# Altium project CPCIS_PWR_MOD_AC.PrjPCB (part 2 of 2)

## Sheet PWR_stage_AC.SchDoc
size 420 x 297 mm; SPICEModelCacheMYOJSQKR: <root> / <DocumentId>MYOJSQKR</DocumentId> / <CacheFrame Number="0"> / <Model Name="890283326009cs_1uf" Kind="CKT"> / <Text>******* / .subckt 890283326009CS_1uF 1 2 / Rser 1 3 0.0252581351943 / Lser 2 4 1.0459517867E-08 / C1 3 4 0.000001 / Rpar 3 4 10000000000 / .ends 890283326009CS_1uF</Text> / </Model> / <Model Name="1210_885342209009_1nf" Kind="CKT"> / <Text>******* / .subckt 1210_885342209009_1nF 1 2 / Rser 1 3 0.343504568556 / Lser 2 4 3.91503622E-10 / C1 3 4 0.000000001 / Rpar 3 4 10000000000 / .ends 1210_885342209009_1nF</Text> / </Model> / <Model Name="1812_885342211008_4.7nf" Kind="CKT"> / <Text>******* / .subckt 1812_885342211008_4.7nF 1 2 / Rser 1 3 0.157731534341 / Lser 2 4 5.5102414E-10 / C1 3 4 0.0000000047 / Rpar 3 4 10000000000 / .ends 1812_885342211008_4.7nF</Text> / </Model> / <Model Name="1210_885342209004_33nf" Kind="CKT"> / <Text>******* / .subckt 1210_885342209004_33nF 1 2 / Rser 1 3 0.0267458879248 / Lser 2 4 3.56097176E-10 / C1 3 4 0.000000033 / Rpar 3 4 3030000000 / .ends 1210_885342209004_33nF</Text> / </Model> / <Model Name="890334026027cs_1uf" Kind="CKT"> / <Text>******* / .subckt 890334026027CS_1uF 1 2 / Rser 1 3 0.033 / Lser 2 4 0.0000000137 / C1 3 4 0.000001 / Rpar 3 4 10000000000 / .ends 890334026027CS_1uF</Text> / </Model> / <Model Name="861011385023_0.33mf" Kind="CKT"> / <Text>***** / .subckt 861011385023_0.33mF 1 2 / Rser 1 3 0.22242 / Lser 2 4 1.2037845668E-08 / C1 3 4 0.00033 / Rpar 3 4 151515.151515152 / .ends 861011385023_0.33mF</Text> / </Model> / <Model Name="860080474012_330uf" Kind="CKT"> / <Text>******* / .subckt 860080474012_330uF 1 2 / Rser 1 3 0.047373566599 / Lser 2 4 6.401102138E-09 / C1 3 4 0.00033 / Rpar 3 4 303030.303030303 / .ends 860080474012_330uF</Text> / </Model> / </CacheFrame> / </root>
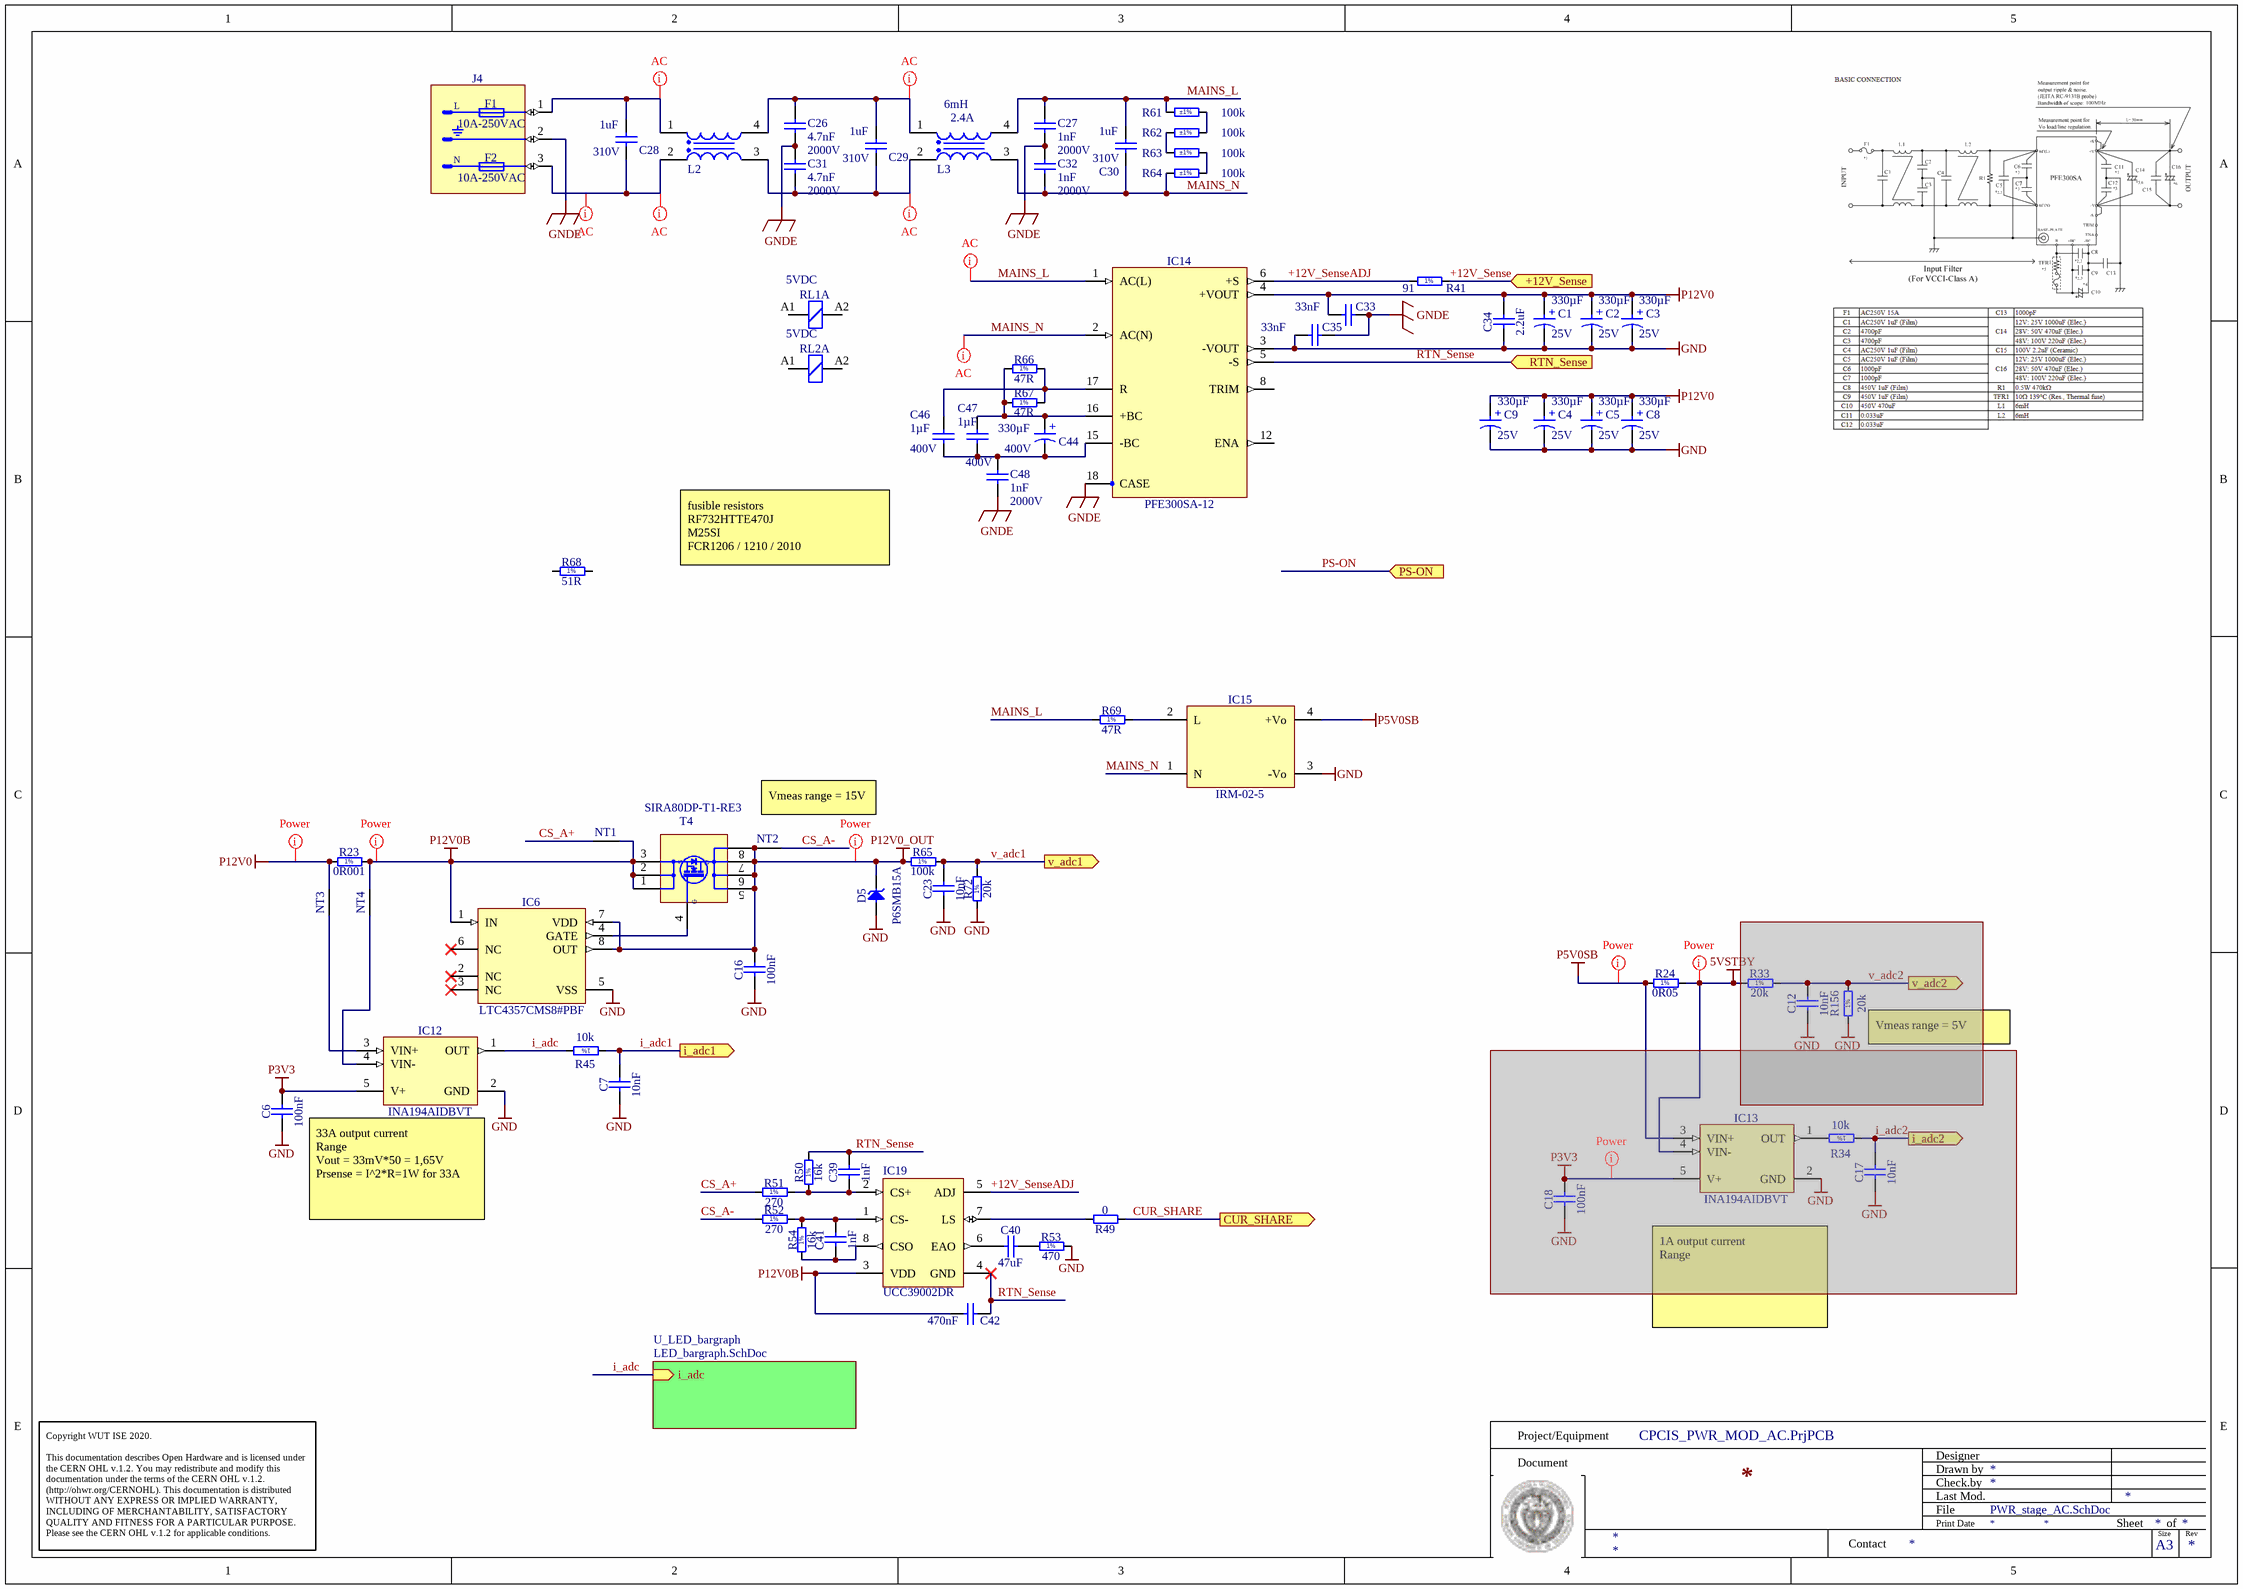
[diagram p1: PWR_stage_AC.SchDoc]

### Parts
(Parts that share a designator on the sheet are numbered #1, #2 ... from top to bottom, then left to right.)
C1#2  Rated Voltage (DC): 25V  [WCAP-ATLI_D8H16]  (hidden comment: 330µF)
C2#2  Rated Voltage (DC): 25V  [WCAP-ATLI_D8H16]  (hidden comment: 330µF)
C3#2  Rated Voltage (DC): 25V  [WCAP-ATLI_D8H16]  (hidden comment: 330µF)
C4#2  Rated Voltage (DC): 25V  [WCAP-ATLI_D8H16]  (hidden comment: 330µF)
C5#2  Rated Voltage (DC): 25V  [WCAP-ATLI_D8H16]  (hidden comment: 330µF)
C6  100nF  [CAPC1005X55N]
C7  10nF  [CAPC1005X55N]
C8#2  Rated Voltage (DC): 25V  [WCAP-ATLI_D8H16]  (hidden comment: 330µF)
C9#2  Rated Voltage (DC): 25V  [WCAP-ATLI_D8H16]  (hidden comment: 330µF)
C12  10nF  [CAPC1005X55N]  (masked out: inside a compile mask, not in the netlist)
C16  100nF  [CAPC1005X55N]
C17  10nF  [CAPC1005X55N]  (masked out: inside a compile mask, not in the netlist)
C18  100nF  [CAPC1005X55N]  (masked out: inside a compile mask, not in the netlist)
C23  10nF  [CAPC1005X55N]
C26  Rated Voltage (DC): 2000V  [WCAP-CSMH_1812_L4.5W3.2H2]  (hidden comment: 4.7nF)
C27  Rated Voltage (DC): 2000V  [WCAP-CSMH_1210_L3.2W2.5H1.25]  (hidden comment: 1nF)
C28  Rated Voltage (AC): 310V  [WCAP-FTXX_L26W11H20_CS]  (hidden comment: 1uF)
C29  Rated Voltage (AC): 310V  [WCAP-FTXX_L26W11H20_CS]  (hidden comment: 1uF)
C30  Rated Voltage (AC): 310V  [WCAP-FTXX_L26W11H20_CS]  (hidden comment: 1uF)
C31  Rated Voltage (DC): 2000V  [WCAP-CSMH_1812_L4.5W3.2H2]  (hidden comment: 4.7nF)
C32  Rated Voltage (DC): 2000V  [WCAP-CSMH_1210_L3.2W2.5H1.25]  (hidden comment: 1nF)
C33  33nF  [WCAP-CSMH_1210_L3.2W2.5H1.6]
C34  2.2uF  [CAPC2013X145N]
C35  33nF  [WCAP-CSMH_1210_L3.2W2.5H1.6]
C39  1nF  [CAPC1005X55N]
C40  47uF  [CAPC1608X100N]
C41  1nF  [CAPC1005X55N]
C42  470nF  [CAPC1608X87N]
C44  Rated Voltage (DC): 400V  [WCAP-AIG8_D30H30]  (hidden comment: 330µF)
C46  Rated Voltage (DC): 400V  [WCAP-FTBP_L26W8.5H17]  (hidden comment: 1µF)
C47  Rated Voltage (DC): 400V  [WCAP-FTBP_L26W8.5H17]  (hidden comment: 1µF)
C48  Rated Voltage (DC): 2000V  [WCAP-CSMH_1210_L3.2W2.5H1.25]  (hidden comment: 1nF)
D5  P6SMB15A  [DIOM5436X261N]
F1  10A-250VAC  [FUSE_5X20_GLASS_v]
F2  10A-250VAC  [FUSE_5X20_GLASS_v]
IC6  LTC4357CMS8#PBF  [SOP65P490X110-8N]
IC12  INA194AIDBVT  [SOT95P280X145-5N]
IC13  INA194AIDBVT  [SOT95P280X145-5N]  (masked out: inside a compile mask, not in the netlist)
IC14  PFE300SA-12  [PWS_TDK-LAMBDA_PFE300/500SA]
IC15  IRM-02-5  [PWS_MEANWELL_IRM-02]
IC19  UCC39002DR  [D0008A_N]
J4  IEC  [SCHURTER_GSF1.2202.31]  (value not drawn)
L2  6mH  [WE-FCLP_FT16H]  (value not drawn)
L3  Rated Current: 2.4A  [WE-FCLP_FT16H]  (hidden comment: 6mH)
NT1  Net Tie  [Net Tie]  (value not drawn)  (net tie, no BOM)
NT2  Net Tie  [Net Tie]  (value not drawn)  (net tie, no BOM)
NT3  Net Tie  [Net Tie]  (value not drawn)  (net tie, no BOM)
NT4  Net Tie  [Net Tie]  (value not drawn)  (net tie, no BOM)
R23  0R001  [RESM11670X254N]
R24  0R05  [RESC2012X60N]
R33  20k  [RESC1005X40N]  (masked out: inside a compile mask, not in the netlist)
R34  10k  [RESC1005X40N]  (masked out: inside a compile mask, not in the netlist)
R41  91  [RESC1608X55N]
R45  10k  [RESC1005X40N]
R49  0  [RESC1608X55N]
R50  16k  [RESC1608X55N]
R51  270  [RESC1608X55N]
R52  270  [RESC1608X55N]
R53  470  [RESC1005X40N]
R54  16k  [RESC1608X55N]
R61  100k  Tolerance: ±1%  [RESC3216X65N]
R62  100k  Tolerance: ±1%  [RESC3216X65N]
R63  100k  Tolerance: ±1%  [RESC3216X65N]
R64  100k  Tolerance: ±1%  [RESC3216X65N]
R65  100k  [RESC1005X40N]
R66  47R  [RESC5025X65N]
R67  47R  [RESC5025X65N]
R68  51R  [RESC5025X65N]
R69  47R  [RESC5025X65N]
R72  20k  [RESC1005X40N]
R156  20k  [RESC1005X40N]  (masked out: inside a compile mask, not in the netlist)
RL1  value 5VDC  [REL_TYCO-SCHRACK_SNR]  (hidden comment: REL_TYCO-SCHRACK_SNR Form A)  (part A of 2)
RL2  value 5VDC  [REL_TYCO-SCHRACK_SNR]  (hidden comment: REL_TYCO-SCHRACK_SNR Form C)  (part A of 2)
T4  SIRA80DP-T1-RE3  [VISHAY_POWERPAK-SO-8-SINGLE]

### Sub-sheets
U_LED_bargraph = LED_bargraph.SchDoc: i_adc (in)

### Ports
+12V_Sense (in), CUR_SHARE (out), i_adc1 (out), i_adc2 (out), PS-ON (in), RTN_Sense (in), v_adc1 (out), v_adc2 (out)

### Nets
5VSTBY: R24.2
GND: C1#2.2(N) C2#2.2(N) C3#2.2(N) C4#2.2(N) C5#2.2(N) C6.1 C7.1 C8#2.2(N) C9#2.2(N) C16.1 C23.1 C34.1 C35.2 D5.2(A) IC6.5(VSS) IC12.2(GND) IC14.3(-VOUT) IC15.3(-Vo) R53.2 R72.1
GNDE: C26.1 C27.1 C31.2 C32.2 C33.1 C35.1 C48.1 IC14.18(CASE) J4.2
P3V3: C6.2 IC12.5(V+)
P5V0SB: IC15.4(+Vo) R24.1
P12V0: C1#2.1(P) C2#2.1(P) C3#2.1(P) C4#2.1(P) C5#2.1(P) C8#2.1(P) C9#2.1(P) C33.2 C34.2 IC14.4(+VOUT) NT3.2 R23.1
P12V0_OUT: C16.2 D5.1(C) IC6.7(VDD) IC6.8(OUT) NT2.1 R65.1 T4.D
P12V0B: C42.2 IC6.1(IN) IC19.3(VDD) NT1.2 NT4.2 R23.2 T4.1(S) T4.2(S) T4.3(S)
+12V_Sense: R41.1 ; port +12V_Sense
+12V_SenseADJ: IC14.6(+S) IC19.5(ADJ) R41.2
CS_A+: NT1.1 R51.1
CS_A-: NT2.2 R52.1
CUR_SHARE: R49.1 ; port CUR_SHARE
i_adc: IC12.1(OUT) R45.2 ; sheet U_LED_bargraph/i_adc
i_adc1: C7.2 R45.1 ; port i_adc1
MAINS_L: C27.2 C30.2 IC14.1(AC(L)) L3.4 R61.1 R69.1
MAINS_N: C30.1 C32.1 IC14.2(AC(N)) IC15.1(N) L3.3 R64.1
RTN_Sense: C39.2 C42.1 IC14.5(-S) IC19.4(GND) R50.2 ; port RTN_Sense
v_adc1: C23.2 R65.2 R72.2 ; port v_adc1
NetC26_2: C26.2 C29.2 L2.4 L3.1
NetC28_1: C28.1 J4.3 L2.2
NetC28_2: C28.2 J4.1 L2.1
NetC29_1: C29.1 C31.1 L2.3 L3.2
NetC39_1: C39.1 IC19.2(CS+) R50.1 R51.2
NetC40_1: C40.1 IC19.6(EAO)
NetC40_2: C40.2 R53.1
NetC41_1: C41.1 IC19.8(CSO) R54.1
NetC41_2: C41.2 IC19.1(CS-) R52.2 R54.2
NetC44_1: C44.1(P) C47.2 IC14.16(+BC) R66.1 R67.1
NetC44_2: C44.2(N) C46.1 C47.1 C48.2 IC14.15(-BC)
NetC46_2: C46.2 IC14.17(R) R66.2 R67.2
NetIC6_4: IC6.4(GATE) T4.4(S)
NetIC12_3: IC12.3(VIN+) NT3.1
NetIC12_4: IC12.4(VIN-) NT4.1
NetIC15_2: IC15.2(L) R69.2
NetIC19_7: IC19.7(LS) R49.2
NetR61_2: R61.2 R62.2
NetR62_1: R62.1 R63.1
NetR63_2: R63.2 R64.2

Not connected (* = marked no-connect by the designer): IC6 2(NC)* 3(NC)* 6(NC)*; IC14 8(TRIM) 12(ENA); R68 1 2; RL1 A1 A2; RL2 A1 A2

### Layout directives
net class Power: 5VSTBY, (no net found under the mark), P5V0SB, P12V0, P12V0_OUT, P12V0B
net class AC: MAINS_L, MAINS_N, NetC26_2, NetC28_1, NetC28_2, NetC29_1

### Notes on the sheet
- fusible resistors
  RF732HTTE470J
  M25SI
  FCR1206 / 1210 / 2010
  tht FKN100JR-73-10R
- Vmeas range = 15V
- (near R156) Vmeas range = 5V
- 33A output current
  Range
  Vout = 33mV*50 = 1,65V
  Prsense = I^2*R=1W for 33A
- 1A output current
  Range
- Project/Equipment
- Document
- Designer
- Drawn by
- Check.by
- Copyright WUT ISE 2020.
  This documentation describes Open Hardware and is licensed under the CERN OHL v.1.2. You may redistribute and modify this documentation under the terms of the CERN OHL v.1.2. (http://ohwr.org/CERNOHL). This documentation is distributed WITHOUT ANY EXPRESS OR IMPLIED WARRANTY, INCLUDING OF MERCHANTABILITY, SATISFACTORY QUALITY AND FITNESS FOR A PARTICULAR PURPOSE. Please see the CERN OHL v.1.2 for applicable conditions.
- Contact
- File
- Last Mod.
- Print Date
- Sheet
- Size
- A3
- of
- Rev
- (in symbol 860080474012) +
- (in symbol 861011385023) +
- (in symbol Q_SIRA80DP-T1-RE3) 7; 6; G; 5
- (in symbol R0402_10K_1%_0.0625W_100PPM) 1%
- (in symbol R0402_20K_1%_0.0625W_100PPM) 1%
- (in symbol R0402_100K_1%_0.0625W_100PPM) 1%
- (in symbol R0402_470R_1%_0.0625W_100PPM) 1%
- (in symbol R0603_16K_1%_0.1W_100PPM) 1%
- (in symbol R0603_91R_1%_0.1W_100PPM) 1%
- (in symbol R0603_270R_1%_0.1W_100PPM) 1%
- (in symbol R0805_0R05_1%_0.25W_300PPM) 1%
- (in symbol R4527_0R001_1%_2W_75PPM) 1%
- (in symbol RES_2010_51R) 1%
- (in symbol SCHURTER_GSF1.2202.31) L; N

### Library data of the parts
C1#2 C2#2 C3#2 C4#2 C5#2 C8#2 C9#2 = 860080474012: WCAP-ATLI Aluminum Electrolytic Capacitor, Radial, THT, D8 x H16mm, 330µF, 25V; Manufacturer: Wurth Elektronik; Capacitance Tolerance: +/-20%; Dissipation Factor: 10%; Endurance: 3000h; Leakage Current: 82.5µA; Ripple Current: 990mA; Technical Reference: ATEE160331M025DSPA7C000; Manufacturer Part Number: 860080474012; Category: Aluminum Electrolytic Capacitors; Match Code: WCAP-ATLI; ComponentLink1Description: Website Link; ComponentLink1URL: https://www.we-online.com/redexpert/article/860080474012?ad; ComponentLink2Description: Datasheet Link; ComponentLink2URL: https://www.we-online.com/redexpert/spec/860080474012?ad; Mount: Through Hole; Operating Temperature Max: 105°C; Operating Temperature Min: -55°C; Packaging: Ammo Pack; Height: 16mm; Diameter: 8mm; Capacitance: 330µF
C6 C16 C18 = CC0402_100NF_25V_10%_X7R_YUDEN_TMK105B7104KVHF: Non-polarised capacitor; Part Description: SMD Multilayer Chip Ceramic Capacitor (High Dielectric Type) for Automotive / Industrial Applications; Manufacturer: TAIYO YUDEN; Voltage: 25V; TC: X7R; Tolerance: ±10%; Part Number: CC0402_100NF_25V_10%_X7R_YUDEN_TMK105B7104KVHF; Component Kind: Standard; Component Type: Standard; Pin Count: 2; Value: 100nF; Status: Not Recommended; Manufacturer Part Number: TMK105B7104KVHF; Case: 0402; Mounted: Yes; Socket: No; SMD: Yes; Sense: No; HelpURL: \\cern.ch\dfs\Applications\Altium\Datasheets\CC0402_TAIYO-YUDEN_TMK105B7104KVHF.pdf; Author: CERN DEM JLC; CreateDate: 10/05/2017; LatestRevisionDate: 10/05/2017; ComponentHeight: 0.55mm
C7 C12 C17 C23 = CC0402_10NF_50V_10%_X7R: Non-polarised capacitor; Part Description: SMD Multilayer Chip Ceramic Capacitor; Manufacturer: GENERIC; Manufacturer1 Part Number: GRM155R71H103KA88D; Voltage: 50V; TC: X7R; Tolerance: ±10%; Part Number: CC0402_10NF_50V_10%_X7R; Component Kind: Standard; Component Type: Standard; Pin Count: 2; Value: 10nF; Status: None; Manufacturer Part Number: CC0402_10NF_50V_10%_X7R; Case: 0402; Mounted: Yes; Socket: No; SMD: Yes; Sense: No; Manufacturer1 Example: MURATA; Manufacturer1 ComponentHeight: 0.55mm; HelpURL: \\cern.ch\dfs\Applications\Altium\Datasheets\CC0402_X7R_MURATA_GRM.pdf; Author: CERN DEM MR; CreateDate: 08/01/2016; LatestRevisionDate: 08/01/2016
C26 C31 = 885342211008: WCAP-CSMH Multilayer Ceramic Chip Capacitor, Mid and High Voltage, size 1812, X7R Class II, 4.7nF, 2000VDC; Manufacturer: Wurth Elektronik; Case/Size Code: 1812; Capacitance Tolerance: 10%; Dissipation Factor: 2.5%; Insulation Resistance: 10GΩ; Technical Reference: X7R1812472KB00DFCT10000; Manufacturer Part Number: 885342211008; Category: Multilayer Ceramic Chip Capacitors; Match Code: WCAP-CSMH; ComponentLink1Description: Website Link; ComponentLink1URL: https://www.we-online.com/redexpert/article/885342211008?ad; ComponentLink2Description: Datasheet Link; ComponentLink2URL: https://www.we-online.com/redexpert/spec/885342211008?ad; Mount: Surface Mount; Operating Temperature Max: 125°C; Operating Temperature Min: -55°C; Packaging: Tape and Reel; Length: 4.5mm; Width: 3.2mm; Height: 2mm; Capacitance: 4.7nF; Ceramic Type: X7R Class II
C27 C32 C48 = 885342209009: WCAP-CSMH Multilayer Ceramic Chip Capacitor, Mid and High Voltage, size 1210, X7R Class II, 1nF, 2000VDC; Manufacturer: Wurth Elektronik; Case/Size Code: 1210; Capacitance Tolerance: 10%; Dissipation Factor: 2.5%; Insulation Resistance: 10GΩ; Technical Reference: X7R1210102KB00DFCT10000; Manufacturer Part Number: 885342209009; Category: Multilayer Ceramic Chip Capacitors; Match Code: WCAP-CSMH; ComponentLink1Description: Website Link; ComponentLink1URL: https://www.we-online.com/redexpert/article/885342209009?ad; ComponentLink2Description: Datasheet Link; ComponentLink2URL: https://www.we-online.com/redexpert/spec/885342209009?ad; Mount: Surface Mount; Operating Temperature Max: 125°C; Operating Temperature Min: -55°C; Packaging: Tape and Reel; Length: 3.2mm; Width: 2.5mm; Height: 1.25mm; Capacitance: 1nF; Ceramic Type: X7R Class II
C28-C30 = 890334026027CS: WCAP-FTXX Film Capacitor, THT, L26 x W11 x H20mm, 1uF, 310V; Manufacturer: Wurth Elektronik; Capacitance Tolerance: +/-10%; Dissipation Factor @1kHz: 0.1%; Dissipation Factor @10kHz: 0.7%; Insulation Resistance: 10.00GOhm; Pitch: 22.5mm; Rate of Voltage Rise: 170V/us; Technical Reference: MXXP225105K310ACPP36004; Manufacturer Part Number: 890334026027CS; Category: Film Capacitors; Match Code: WCAP-FTXX; ComponentLink1Description: Website Link; ComponentLink1URL: https://www.we-online.com/redexpert/article/890334026027CS?ad; ComponentLink2Description: Datasheet Link; ComponentLink2URL: https://www.we-online.com/redexpert/spec/890334026027CS?ad; Mount: Through Hole; Operating Temperature Max: 105°C; Operating Temperature Min: -40°C; Packaging: Bulk; Length: 26mm; Width: 11mm; Height: 20mm; Capacitance: 1uF
C33 C35 = 885342209004: WCAP-CSMH Multilayer Ceramic Chip Capacitor, Mid and High Voltage, size 1210, X7R Class II, 33nF, 630VDC; Manufacturer: Wurth Elektronik; Case/Size Code: 1210; Capacitance Tolerance: 10%; Dissipation Factor: 2.5%; Insulation Resistance: 3.03GΩ; Rated Voltage (DC): 630V; Technical Reference: X7R1210333K630DFCT10000; Manufacturer Part Number: 885342209004; Category: Multilayer Ceramic Chip Capacitors; Match Code: WCAP-CSMH; ComponentLink1Description: Website Link; ComponentLink1URL: https://www.we-online.com/redexpert/article/885342209004?ad; ComponentLink2Description: Datasheet Link; ComponentLink2URL: https://www.we-online.com/redexpert/spec/885342209004?ad; Mount: Surface Mount; Operating Temperature Max: 125°C; Operating Temperature Min: -55°C; Packaging: Tape and Reel; Length: 3.2mm; Width: 2.5mm; Height: 1.6mm; Capacitance: 33nF; Ceramic Type: X7R Class II
C34 = CC0805_2.2UF_35V_10%_X7R_TDK_CGA4J1X7R1V225K125AC: Non-polarised capacitor; Part Description: SMD Multilayer Chip Ceramic Capacitor (Automotive Grade); Manufacturer: TDK; Voltage: 35V; TC: X7R; Tolerance: ±10%; Part Number: CC0805_2.2UF_35V_10%_X7R_TDK_CGA4J1X7R1V225K125AC; Component Kind: Standard; Component Type: Standard; Pin Count: 2; Value: 2.2uF; Status: Not Recommended; Manufacturer Part Number: CGA4J1X7R1V225K125; Case: 0805; Mounted: Yes; Socket: No; SMD: Yes; Sense: No; ComponentHeight: 1.45mm; HelpURL: \\cern.ch\dfs\Applications\Altium\Datasheets\CC0805_X7R_TDK_CGA.pdf; Author: CERN DEM BC; CreateDate: 26.02.2016; LatestRevisionDate: 13.09.2016
C39 C41 = CC0402_1NF_50V_10%_X7R: Non-polarised capacitor; Part Description: SMD Multilayer Chip Ceramic Capacitor; Manufacturer: GENERIC; Manufacturer1 Part Number: 223858715623; Voltage: 50V; TC: X7R; Tolerance: ±10%; Part Number: CC0402_1NF_50V_10%_X7R; Component Kind: Standard; Component Type: Standard; Pin Count: 2; Value: 1nF; Status: Not Recommended; Manufacturer Part Number: CC0402_1NF_50V_10%_X7R; Case: 0402; Mounted: Yes; Socket: No; SMD: Yes; Sense: No; Manufacturer1 Example: PHYCOMP; Manufacturer1 ComponentHeight: 0.55mm; HelpURL: \\cern.ch\dfs\Applications\Altium\Datasheets\CC0402_X7R_PHYCOMP.pdf; Author: CERN DEM JLC; CreateDate: 03.12.2007; LatestRevisionDate: 03.12.2007
C40 = CC0603_47UF_6.3V_20%_X5R: Non-polarised capacitor; Part Description: SMD Multilayer Chip Ceramic Capacitor; Manufacturer: GENERIC; Manufacturer1 Part Number: GRM188R60J476ME15D; Voltage: 6.3V; TC: X5R; Tolerance: ±20%; Part Number: CC0603_47UF_6.3V_20%_X5R; Component Kind: Standard; Component Type: Standard; Pin Count: 2; Value: 47uF; Status: None; Manufacturer Part Number: CC0603_47UF_6.3V_20%_X5R; Case: 0603; Mounted: Yes; Socket: No; SMD: Yes; Sense: No; Manufacturer1 Example: MURATA; Manufacturer1 ComponentHeight: 1mm; HelpURL: \\cern.ch\dfs\Applications\Altium\Datasheets\CC0603_MURATA_GRM188R60J476ME15D.pdf; Author: CERN DEM JLC; CreateDate: 01.02.2018; LatestRevisionDate: 01.02.2018
C42 = CC0603_470NF_50V_10%_X5R: Non-polarised capacitor; Part Description: SMD Multilayer Chip Ceramic Capacitor; Manufacturer: GENERIC; Manufacturer1 Part Number: C1608X5R1H474K080; Voltage: 50V; TC: X5R; Tolerance: ±10%; Part Number: CC0603_470NF_50V_10%_X5R; Component Kind: Standard; Component Type: Standard; Pin Count: 2; Value: 470nF; Status: None; Manufacturer Part Number: CC0603_470NF_50V_10%_X5R; Case: 0603; Mounted: Yes; Socket: No; SMD: Yes; Sense: No; Manufacturer1 Example: TDK; Manufacturer1 ComponentHeight: 0.9mm; HelpURL: \\cern.ch\dfs\Applications\Altium\Datasheets\CC0603_X5R_TDK_C.pdf; Author: CERN DEM MR; CreateDate: 29.02.2016; LatestRevisionDate: 29.02.2016
C44 = 861011385023: WCAP-AIG8 Aluminum Electrolytic Capacitor, Snap-In, D30 x H30mm, 330µF, 400V; Manufacturer: Wurth Elektronik; Capacitance Tolerance: +/-20%; Dissipation Factor: 20%; Endurance: 2000h; Leakage Current: 2640µA; Ripple Current: 2050mA; Technical Reference: ANAP300331M400DSIC2B000; Manufacturer Part Number: 861011385023; Category: Aluminum Electrolytic Capacitors; Match Code: WCAP-AIG8; ComponentLink1Description: Website Link; ComponentLink1URL: https://www.we-online.com/redexpert/article/861011385023?ad; ComponentLink2Description: Datasheet Link; ComponentLink2URL: https://www.we-online.com/redexpert/spec/861011385023?ad; Mount: Through Hole; Operating Temperature Max: 85°C; Operating Temperature Min: -25°C; Packaging: Tray; Height: 30mm; Diameter: 30mm; Capacitance: 330µF
C46 C47 = 890283326009CS: WCAP-FTBP Film Capacitor, THT, L26 x W8.5 x H17mm, 1µF, 400V; Manufacturer: Wurth Elektronik; Capacitance Tolerance: +/-5%; Dissipation Factor @1kHz: 0.1%; Dissipation Factor @10kHz: 0.32%; Dissipation Factor @100kHz: 2.2%; Insulation Resistance: 10000Ω x F; Pitch: 22.5mm; Rate of Voltage Rise: 95V/µs; Technical Reference: MPPP225105J400DCPP35004; Manufacturer Part Number: 890283326009CS; Category: Film Capacitors; Match Code: WCAP-FTBP; ComponentLink1Description: Website Link; ComponentLink1URL: https://www.we-online.com/redexpert/article/890283326009CS?ad; ComponentLink2Description: Datasheet Link; ComponentLink2URL: https://www.we-online.com/redexpert/spec/890283326009CS?ad; Mount: Through Hole; Operating Temperature Max: 105°C; Operating Temperature Min: -40°C; Packaging: Carton; Length: 26mm; Width: 8.5mm; Height: 17mm; Capacitance: 1µF
D5 = P6SMB15A: Transient Voltage Suppressor Diode (Uni-Directional); Part Description: Uni-directional Transient Voltage Suppressor (TVS) Diode; Manufacturer: LITTELFUSE; Voltage: 15V; Power: 600W; PressFit: No; Bonding: No; Part Number: P6SMB15A; Component Kind: Standard; Component Type: Standard; Device: P6SMB15A; PackageDescription: DO-214-AA/SMB Diode, Molded Body; 5.40mm L X 3.62mm W X 2.61mm H, IPC Medium Density; Manufacturer Part Number: P6SMB15A; Pin Count: 2; Case: SMB; Mounted: Yes; Socket: No; SMD: Yes; Sense: No; ComponentHeight: 2.61mm; HelpURL: \\cern.ch\dfs\Applications\Altium\Datasheets\P6SMB15A.pdf; Author: CERN DEM JLC; CreateDate: 12.07.2017; LatestRevisionDate: 12.07.2017
F1 F2 = FUSE_SCHURTER_0034.3127_v: Fuse; Part Description: Cylindrical 5x20 mm, Time-Lag T Miniature Fuse, FST Series; PressFit: No; Part Number: FUSE_SCHURTER_0034.3127_v; Component Kind: Accessories; Component Type: Standard; Pin Count: 0; PackageDescription: 5x20mm Cylindrical Fuse, SCHURTER FST5X20 Series; Family: Fuse; Mounted: Yes; Socket: Yes; SMD: No; Sense: No; Value: 10A-250VAC; Manufacturer: SCHURTER; Manufacturer Part Number: 0034.3127; ComponentHeight: 20.5mm; HelpURL: \\cern.ch\dfs\Applications\Altium\Datasheets\FUSE_SCHURTER_FST5X20.pdf; Author: CERN DEM JLC; CreateDate: 28.01.2013; LatestRevisionDate: 28.01.2013
IC6 = LTC4357CMS8#PBF: Positive High Voltage Ideal Diode Controller; Manufacturer: LINEAR TECHNOLOGY; PressFit: No; Bonding: No; Part Number: LTC4357CMS8#PBF; Component Kind: Standard; Component Type: Standard; Device: LTC4357CMS8#PBF; PackageDescription: SOP, 0.65mm, Pitch; 8 Pin, 3.0mm W X 3.0mm L X 1.10mm H Body, IPC Medium Density; Part Description: Positive High Voltage Ideal Diode Controller; Manufacturer Part Number: LTC4357CMS8#PBF; Pin Count: 8; Case: MSOP8; Mounted: Yes; Socket: No; SMD: Yes; Sense: No; ComponentHeight: 1.1mm; Author: GK; HelpURL: \\cern.ch\dfs\Applications\Altium\Datasheets\LTC4359CMS8#PBF.pdf; CreateDate: 25.02.2015; LatestRevisionDate: 25.02.2015
IC12 IC13 = INA194AIDBVT: Current Shunt Monitor -16V to +80V Common-Mode Range; Manufacturer: TEXAS INSTRUMENTS; PressFit: No; Bonding: No; Part Number: INA194AIDBVT; Component Kind: Standard; Component Type: Standard; Device: INA194AIDBVT; PackageDescription: SOT, 0.95mm pitch; 5 pin, 1.60mm W X 2.90mm L X 1.45mm H body, IPC Medium Density; Part Description: Current Shunt Monitor -16V to +80V Common-Mode Range; Manufacturer Part Number: INA194AIDBVT; Pin Count: 5; Case: SOT23-5; Mounted: Yes; Socket: No; SMD: Yes; Sense: No; ComponentHeight: 1.45mm; Author: CERN DEM JLC; HelpURL: \\cern.ch\dfs\Applications\Altium\Datasheets\INA194AIDBVT.pdf; CreateDate: 10.05.2010; LatestRevisionDate: 10.05.2010
IC14 = PWS_TDK-LAMBDA_PFE300SA: 85-264VAC To 12VDC 300W Single Output Power Module; Part Description: 85-264VAC to 12VDC 300W AC-DC Power Module; PressFit: No; Sense Comment: Non-washable; Bonding: No; Status Comment: Sensitive (See Sensitive Field); Part Number: PFE300SA-12; Component Kind: Standard; Component Type: Standard; Device: PFE300SA-12; Footprint: PWS_TDK-LAMBDA_PFE500F; PackageDescription: PFE500F Outline, Body 122x70mm, AC-DC Power Module; Status: Not Recommended; Manufacturer: TDK-LAMBDA; Manufacturer Part Number: PFE300SA-12; Pin Count: 17; Mounted: Yes; Socket: No; SMD: No; Sense: Yes; ComponentHeight: 13.4mm; HelpURL: \\cern.ch\dfs\Applications\Altium\Datasheets\PFE500F-12.pdf; Author: GK; CreateDate: 22.02.2018; LatestRevisionDate: 22.02.2018
IC15 = AC_DC_IRM-02-5: Power Supply; Part Description: 85-305VAC to 5VDC (400mA) 2W Power Supply; Manufacturer: MEAN WELL; PressFit: No; Bonding: No; Part Number: IRM-02-5; Component Kind: Standard; Component Type: Standard; Device: IRM-02-5; PackageDescription: IRM-02 Series, Body 33.7x22.2mm, Power Supply; Status: None; Manufacturer Part Number: IRM-02-5; Pin Count: 4; Mounted: Yes; Socket: No; SMD: No; Sense: No; ComponentHeight: 15mm; HelpURL: \\cern.ch\dfs\Applications\Altium\Datasheets\IRM-02-24.pdf; Author: GK; CreateDate: 14.02.2018; LatestRevisionDate: 14.02.2018
IC19 = CMP-0335-00043-2: Advanced Loadshare Controller with UVLO, 4.375 to 14.25 V Supply, 0 to 70 degC, 8-pin SOIC (D), Green (RoHS & no Sb/Br); Manufacturer: Texas Instruments; Share Bus: Single-Ended; Operating Supply Current(mA): 2.5; Rating: Catalog; Operating Supply(Min)(V): 4.375; UVLO: TRUE; Operating Supply(Max)(V): 14.25; Startup Current(uA): 2500; DatasheetVersion: SLUS495H; ComponentLink1URL: http://www.ti.com/general/docs/lit/getliterature.tsp?genericPartNumber=UCC39002&fileType=pdf; PackageReference: D0008A; ComponentLink1Description: Datasheet; Mounting Technology: Surface Mount; PackageVersion: revM, Jun-2011; SubFamily: Load Share; Code_JEDEC: MS-012AA; PartNumber: UCC39002DR; PackageDescription: 8-Pin Plastic Small Outline Integrated Circuit, 4.9 x 3.9 mm, Pitch 1.27 mm Pitch; Eco-Plan: Green (RoHS & no Sb/Br)
J4 = SCHURTER_GSF1.2202.31: Connector 3 Male 2P+ 2 Fuse Holder; Part Number: SCHURTER_GSF1.2201.31; Part Description: 10A 250Vac Sandwich Panel Mount (1.5mm) Inlet IEC Connector With 2 Fuseholder 5x20mm And Snap-in PCB Mount; Manufacturer Part Number: GSF1.2201.31; PressFit: No; Component Kind: Standard; Component Type: Standard; Footprint: SCHURTER_GSF1.2201.31; Pin Count: 3; Family: IEC; Mounted: Yes; Socket: No; SMD: No; Sense: No; Status: None; Manufacturer: SCHURTER; ComponentHeight: 24.45mm; HelpURL: \\cern.ch\dfs\Applications\Altium\Datasheets\SCHURTER_GSF1.2202.31.pdf; Author: CERN DEM JMW; CreateDate: 20.09.2012; LatestRevisionDate: 20.09.2012
L2 L3 = 744869161063: WE-FCLP THT Common Mode Power Line Choke, FT16H, 6mH, 2.4A, 0.22Ω; Manufacturer: Wurth Elektronik; Insulation Test Voltage: 1.5kV; Leakage Inductance: 120µH; Material: MnZn; Rated Voltage (AC): 250V; ComponentLink1Description: Manufacturer Link; ComponentLink1URL: https://www.we-online.com/redexpert/article/744869161063?ad; ComponentLink2Description: Datasheet; ComponentLink2URL: https://www.we-online.com/redexpert/spec/744869161063?ad; Manufacturer Part Number: 744869161063; Category: Common Mode Chokes; Match Code: WE-FCLP; Mount: Through Hole; Operating Temperature Max: 125°C; Operating Temperature Min: -40°C; Packaging: Tray; Case/Size Code: FT16H; Length: 24.5mm; Width: 15.5mm; Height: 14.5mm; DC Resistance Max: 0.22Ω; Inductance: 6mH
  L2: Rated Current: 2.4A
NT1-NT4 = Net Tie: Part Description: Net Tie (2 Nets); Mounted: No; Part Number: Net Tie; Component Type: Net Tie; Pin Count: 2; Family: Net Tie; Socket: No; SMD: No; Sense: No; Status: None; ComponentHeight: 0mm; HelpURL: Undefined; Author: CERN DEM JLC; CreateDate: 22.03.2011; LatestRevisionDate: 22.03.2011; PackageDescription: 2 Plated Through Hole For Coaxial Cable Link: Hole Dia.=1.4mm Pad Dia.=2.5mm
R23 = R4527_0R001_1%_2W_75PPM: Resistor - 1%; Part Description: Surface Mount Power Metal Strip® Resistor; Manufacturer: VISHAY DALE; Manufacturer Part Number: WSR21L000FEA; Power: 2W; TC: ±75ppm/°C; PressFit: No; Part Number: R4527_0R001_1%_2W_75PPM; Component Kind: Standard; Component Type: Standard; Pin Count: 2; Value: 0R001; Status: None; Tolerance: ±1%; Case: 4527; Mounted: Yes; Sense: No; Socket: No; SMD: Yes; ComponentHeight: 2.53mm; HelpURL: \\cern.ch\dfs\Applications\Altium\Datasheets\R4527_VISHAY_WSR2.pdf; Author: CERN DEM JLC; CreateDate: 22/03/2011; LatestRevisionDate: 22/03/2011
R24 = R0805_0R05_1%_0.25W_300PPM: Resistor - 1%; Part Description: Low Resistance Thick Film Chip Resistor; Manufacturer: GENERIC; Manufacturer1 Part Number: 235051117500L or RL0805FR-7W0R05L; Power: 0.25W; TC: ±300ppm/°C; PressFit: No; Part Number: R0805_0R05_1%_0.25W_300PPM; Component Kind: Standard; Component Type: Standard; Pin Count: 2; Value: 0R05; Status: Not Recommended; Tolerance: ±1%; Manufacturer Part Number: R0805_0R05_1%_0.25W_300PPM; Case: 0805; Mounted: Yes; Sense: No; Socket: No; SMD: Yes; Manufacturer1 Example: YAGEO PHYCOMP; Manufacturer1 ComponentHeight: 0.60mm; HelpURL: \\cern.ch\dfs\Applications\Altium\Datasheets\R0805_Phycomp_RL0805.pdf; Author: CERN DEM MR; CreateDate: 31.03.2016; LatestRevisionDate: 31.03.2016
R33 R72 R156 = R0402_20K_1%_0.0625W_100PPM: Resistor - 1%; Part Description: General Purpose Thick Film Chip Resistor; Manufacturer: GENERIC; Manufacturer1 Part Number: 232270672003L; TC: ±100ppm/°C; PressFit: No; Part Number: R0402_20K_1%_0.0625W_100PPM; Component Kind: Standard; Component Type: Standard; Pin Count: 2; Value: 20k; Status: Not Recommended; Power: 0.0625W; Tolerance: ±1%; Manufacturer Part Number: R0402_20K_1%_0.0625W_100PPM; Case: 0402; Mounted: Yes; Sense: No; Socket: No; SMD: Yes; Manufacturer1 Example: YAGEO PHYCOMP; Manufacturer1 ComponentHeight: 0.4mm; HelpURL: \\cern.ch\dfs\Applications\Altium\Datasheets\R0402_Phycomp_RC0402.pdf; Author: CERN DEM JLC; CreateDate: 03.12.2007; LatestRevisionDate: 17.10.2012
R34 R45 = R0402_10K_1%_0.0625W_100PPM: Resistor - 1%; Part Description: General Purpose Thick Film Chip Resistor; Manufacturer: GENERIC; Manufacturer1 Part Number: 232270671003L; TC: ±100ppm/°C; PressFit: No; Part Number: R0402_10K_1%_0.0625W_100PPM; Component Kind: Standard; Component Type: Standard; Pin Count: 2; Value: 10k; Status: Not Recommended; Power: 0.0625W; Tolerance: ±1%; Manufacturer Part Number: R0402_10K_1%_0.0625W_100PPM; Case: 0402; Mounted: Yes; Sense: No; Socket: No; SMD: Yes; Manufacturer1 Example: YAGEO PHYCOMP; Manufacturer1 ComponentHeight: 0.4mm; HelpURL: \\cern.ch\dfs\Applications\Altium\Datasheets\R0402_Phycomp_RC0402.pdf; Author: CERN DEM JLC; CreateDate: 03/12/2007; LatestRevisionDate: 17/10/2012
R41 = R0603_91R_1%_0.1W_100PPM: Resistor - 1%; Part Description: General Purpose Thick Film Chip Resistor; Manufacturer: GENERIC; Manufacturer1 Part Number: NRC06F91R0TRF; Power: 0.1W; TC: ±100ppm/°C; PressFit: No; Part Number: R0603_91R_1%_0.1W_100PPM; Component Kind: Standard; Component Type: Standard; Pin Count: 2; Value: 91; Status: Preferred; Tolerance: ±1%; Manufacturer Part Number: R0603_91R_1%_0.1W_100PPM; Case: 0603; Mounted: Yes; Sense: No; Socket: No; SMD: Yes; Manufacturer1 Example: NIC COMPONENT; Manufacturer1 ComponentHeight: 0.55mm; HelpURL: \\cern.ch\dfs\Applications\Altium\Datasheets\R0603_NIC_NRC.pdf; Author: CERN DEM JLC; CreateDate: 03.12.2007; LatestRevisionDate: 13.03.2008
R49 = R0603_0R_JUMPER: Resistor; Part Description: 1A (0.05R Max DC Resistance) Zero Ohm Jumper; Manufacturer: GENERIC; Manufacturer1 Part Number: NRC06Z0; PressFit: No; Part Number: R0603_0R_JUMPER; Component Kind: Standard; Component Type: Standard; Pin Count: 2; Value: 0; Status: Preferred; Manufacturer Part Number: R0603_0R_JUMPER; Case: 0603; Mounted: Yes; Sense: No; Socket: No; SMD: Yes; Manufacturer1 Example: NIC COMPONENT; Manufacturer1 ComponentHeight: 0.55mm; HelpURL: \\cern.ch\dfs\Applications\Altium\Datasheets\R0603_NIC_NRC.pdf; Author: CERN DEM JLC; CreateDate: 03.12.2007; LatestRevisionDate: 13.03.2008
R50 R54 = R0603_16K_1%_0.1W_100PPM: Resistor - 1%; Part Description: General Purpose Thick Film Chip Resistor; Manufacturer: GENERIC; Manufacturer1 Part Number: NRC06F1602TRF; Power: 0.1W; TC: ±100ppm/°C; PressFit: No; Part Number: R0603_16K_1%_0.1W_100PPM; Component Kind: Standard; Component Type: Standard; Pin Count: 2; Value: 16k; Status: Preferred; Tolerance: ±1%; Manufacturer Part Number: R0603_16K_1%_0.1W_100PPM; Case: 0603; Mounted: Yes; Sense: No; Socket: No; SMD: Yes; Manufacturer1 Example: NIC COMPONENT; Manufacturer1 ComponentHeight: 0.55mm; HelpURL: \\cern.ch\dfs\Applications\Altium\Datasheets\R0603_NIC_NRC.pdf; Author: CERN DEM JLC; CreateDate: 03.12.2007; LatestRevisionDate: 13.03.2008
R51 R52 = R0603_270R_1%_0.1W_100PPM: Resistor - 1%; Part Description: General Purpose Thick Film Chip Resistor; Manufacturer: GENERIC; Manufacturer1 Part Number: NRC06F2700TRF; Power: 0.1W; TC: ±100ppm/°C; PressFit: No; Part Number: R0603_270R_1%_0.1W_100PPM; Component Kind: Standard; Component Type: Standard; Pin Count: 2; Value: 270; Status: Preferred; Tolerance: ±1%; Manufacturer Part Number: R0603_270R_1%_0.1W_100PPM; Case: 0603; Mounted: Yes; Sense: No; Socket: No; SMD: Yes; Manufacturer1 Example: NIC COMPONENT; Manufacturer1 ComponentHeight: 0.55mm; HelpURL: \\cern.ch\dfs\Applications\Altium\Datasheets\R0603_NIC_NRC.pdf; Author: CERN DEM JLC; CreateDate: 03.12.2007; LatestRevisionDate: 13.03.2008
R53 = R0402_470R_1%_0.0625W_100PPM: Resistor - 1%; Part Description: General Purpose Thick Film Chip Resistor; Manufacturer: GENERIC; Manufacturer1 Part Number: 232270674701L; TC: ±100ppm/°C; PressFit: No; Part Number: R0402_470R_1%_0.0625W_100PPM; Component Kind: Standard; Component Type: Standard; Pin Count: 2; Value: 470; Status: Not Recommended; Power: 0.0625W; Tolerance: ±1%; Manufacturer Part Number: R0402_470R_1%_0.0625W_100PPM; Case: 0402; Mounted: Yes; Sense: No; Socket: No; SMD: Yes; Manufacturer1 Example: YAGEO PHYCOMP; Manufacturer1 ComponentHeight: 0.4mm; HelpURL: \\cern.ch\dfs\Applications\Altium\Datasheets\R0402_Phycomp_RC0402.pdf; Author: CERN DEM JLC; CreateDate: 03.12.2007; LatestRevisionDate: 17.10.2012
R61-R64 = R1206_100K_1%_0.25W_100PPM: Resistor - 1%; Part Description: General Purpose Thick Film Chip Resistor; Manufacturer: GENERIC; Manufacturer1 Part Number: NRC12F1003TRF; Power: 0.25W; TC: ±100ppm/°C; PressFit: No; Part Number: R1206_100K_1%_0.25W_100PPM; Component Kind: Standard; Component Type: Standard; Pin Count: 2; Value: 100k; Status: Preferred; Manufacturer Part Number: R1206_100K_1%_0.25W_100PPM; Case: 1206; Mounted: Yes; Sense: No; Socket: No; SMD: Yes; Manufacturer1 Example: NIC COMPONENT; Manufacturer1 ComponentHeight: 0.65mm; HelpURL: \\cern.ch\dfs\Applications\Altium\Datasheets\R1206_NIC_NRC.pdf; Author: CERN DEM JLC; CreateDate: 03.12.2007; LatestRevisionDate: 13.03.2008
R65 = R0402_100K_1%_0.0625W_100PPM: Resistor - 1%; Part Description: General Purpose Thick Film Chip Resistor; Manufacturer: GENERIC; Manufacturer1 Part Number: 232270671004L; TC: ±100ppm/°C; PressFit: No; Part Number: R0402_100K_1%_0.0625W_100PPM; Component Kind: Standard; Component Type: Standard; Pin Count: 2; Value: 100k; Status: Not Recommended; Power: 0.0625W; Tolerance: ±1%; Manufacturer Part Number: R0402_100K_1%_0.0625W_100PPM; Case: 0402; Mounted: Yes; Sense: No; Socket: No; SMD: Yes; Manufacturer1 Example: YAGEO PHYCOMP; Manufacturer1 ComponentHeight: 0.4mm; HelpURL: \\cern.ch\dfs\Applications\Altium\Datasheets\R0402_Phycomp_RC0402.pdf; Author: CERN DEM JLC; CreateDate: 03/12/2007; LatestRevisionDate: 17/10/2012
R66 R67 R69 = RES_2010_51R: Fusible resistor 47R 0.5W; Manufacturer: KOA; Manufacturer Part Number: RF732HTTE470J; Power: 0.75W; TC: ±200ppm/°C; Tolerance: ±5%; Part Number: Fusible resistor 47R 0.5W; Component Kind: Standard; Component Type: Standard; Pin Count: 2; Value: 47R; Status: Not recommended; Part Description: Fusible resistor 47R 0.5W; Case: 2010; Mounted: Yes; Sense: No; Socket: No; SMD: Yes; ComponentHeight: 0.65mm; HelpURL: \\cern.ch\dfs\Applications\Altium\Datasheets\R2010_YAGEO_RC2010.pdf; Author: GK; CreateDate: 2016-03-13; LatestRevisionDate: 2015-12-04
R68 = RES_2010_51R: Resistor 51R, 0.75W 5%; Part Number: R2010_51R_5%_0.75W_200PPM; Part Description: General Purpose Thick Film Chip Resistor; Manufacturer: VISHAY; Manufacturer Part Number: CRCW201051R0JNEF; TC: ±200ppm/°C; Component Kind: Standard; Component Type: Standard; Pin Count: 2; Value: 51R; Status: Not recommended; Power: 0.75W; Tolerance: ±5%; Case: 2010; Mounted: Yes; Sense: No; Socket: No; SMD: Yes; ComponentHeight: 0.65mm; HelpURL: \\cern.ch\dfs\Applications\Altium\Datasheets\R2010_YAGEO_RC2010.pdf; Author: GK; CreateDate: 2016-03-13; LatestRevisionDate: 2015-12-04
RL1 = REL_TYCO-SCHRACK_V23092-A1005-A202: SNR Slim PCB Relay Form A (1 NO Contact); Part Description: SPST General Purpose  Slim PCB Relay, SNR Series; Manufacturer: TYCO SCHRACK; Manufacturer Part Number: V23092-A1005-A202 or 8-1415067-1; PressFit: No; Sense Comment: Cleaning Limitation; Status Comment: Sensitive (See Sensitive Field); Part Number: REL_TYCO-SCHRACK_V23092-A1005-A202; Component Kind: Standard; Component Type: Standard; Pin Count: 4; PackageDescription: 5 Leads, Body 28.0 x 5mm, Slim PCB Relay SNR Series; Mounted: Yes; Socket: No; SMD: No; Sense: Yes; Status: Not Recommended; ComponentHeight: 15mm; HelpURL: \\cern.ch\dfs\Applications\Altium\Datasheets\REL_TYCO-SCHRACK_SNR.pdf; Author: CERN DEM JLC; CreateDate: 28.04.2009; LatestRevisionDate: 04.09.2018
RL2 = REL_TYCO-SCHRACK_V23092-A1005-A301: SNR Slim PCB Relay Form C (1 CO Contact); Part Description: SPDT General Purpose  Slim PCB Relay, SNR Series; Manufacturer: TYCO SCHRACK; Manufacturer Part Number: V23092-A1005-A301 or 1393236-2; PressFit: No; Sense Comment: Cleaning Limitation; Status Comment: Sensitive (See Sensitive Field); Part Number: REL_TYCO-SCHRACK_V23092-A1005-A301; Component Kind: Standard; Component Type: Standard; Pin Count: 5; PackageDescription: 5 Leads, Body 28.0 x 5mm, Slim PCB Relay SNR Series; Mounted: Yes; Socket: No; SMD: No; Sense: Yes; Status: Not Recommended; ComponentHeight: 15mm; HelpURL: \\cern.ch\dfs\Applications\Altium\Datasheets\REL_TYCO-SCHRACK_SNR.pdf; Author: CERN DEM JLC; CreateDate: 28.01.2009; LatestRevisionDate: 04.09.2018
T4 = Q_SIRA80DP-T1-RE3: 100A N-Channel 30-V (D-S) MOSFET; Part Number: SI7898DP-T1-E3; Manufacturer: VISHAY SILICONIX; PressFit: No; Bonding: No; Component Kind: Standard; Component Type: Standard; Device: SIRA80DP-T1-RE3; PackageDescription: SOIC, 1.27mm Pitch, 8 Pin, Body 5.89mm W X 4.9mm L X 1.12mm H, PowerPAK® SO-8, (SINGLE); Part Description: 100A N-Channel 30-V (D-S) MOSFET; Manufacturer Part Number: SIRA80DP-T1-RE3; Pin Count: 8; Case: SOIC8; Mounted: Yes; Socket: No; SMD: Yes; Sense: No; ComponentHeight: 1.12mm; HelpURL: \\cern.ch\dfs\Applications\Altium\Datasheets\SI7898DP-T1-E3.pdf; Author: GK; CreateDate: 01.01.2020; LatestRevisionDate: 01.01.202005.03.2013

## Sheet LED_bargraph.SchDoc
size A3
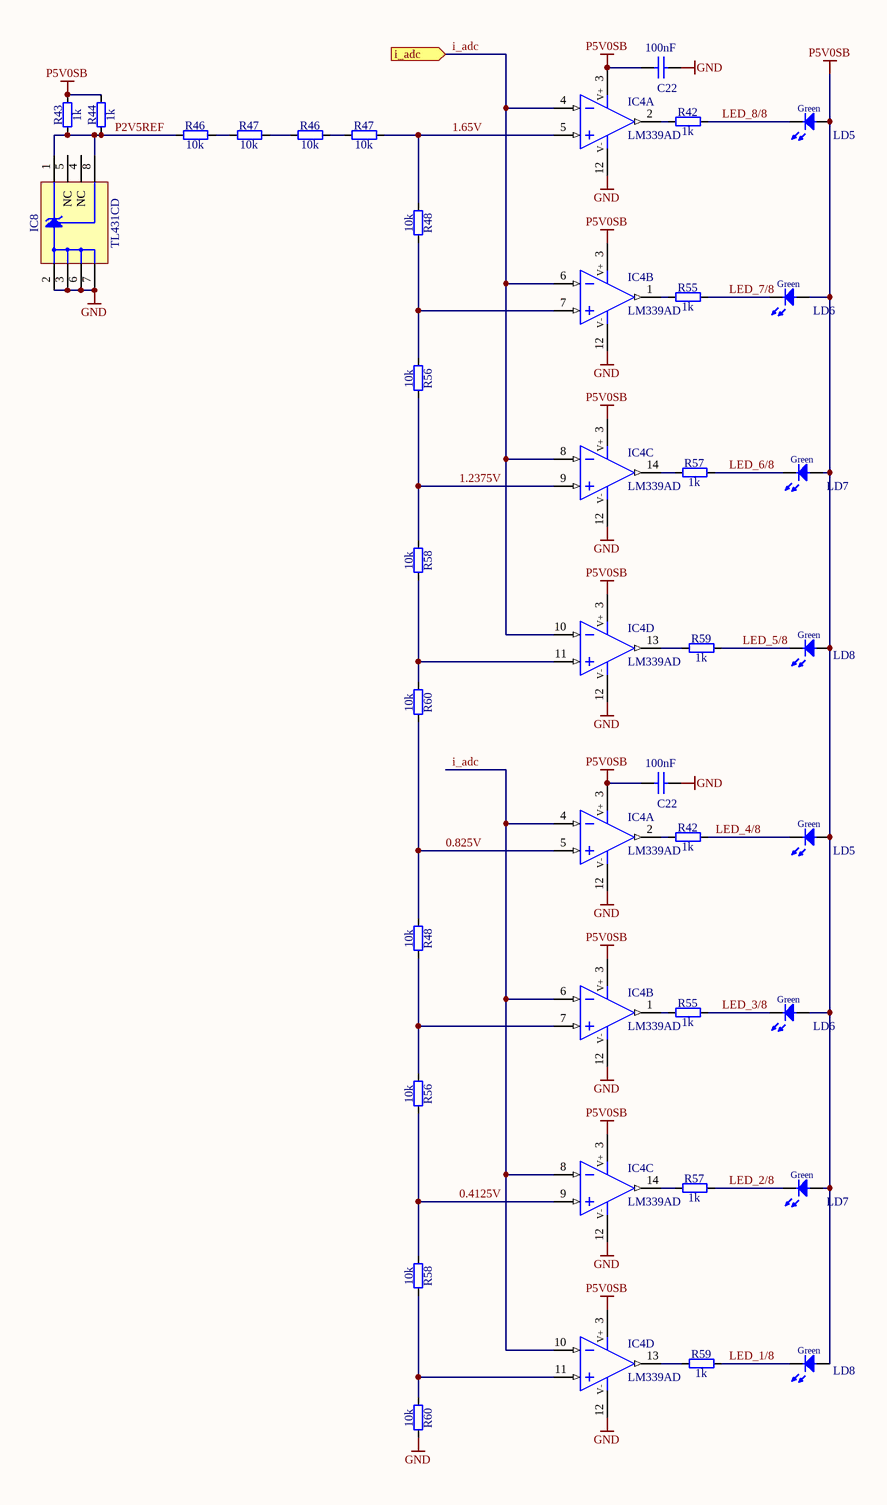
[diagram p2: LED_bargraph.SchDoc]

### Parts
(Parts that share a designator on the sheet are numbered #1, #2 ... from top to bottom, then left to right.)
C22#1  100nF  [CAPC1005X55N]
C22#2  100nF  [CAPC1005X55N]
IC4#1  LM339AD  [SOIC127P600X175-14N]  (parts A,B,C,D of 4)
IC4#2  LM339AD  [SOIC127P600X175-14N]  (parts A,B,C,D of 4)
IC8  TL431CD  [SOIC127P600X175-8N]
LD5#1  Green  [LED_AVAGO_HSME-C120]
LD5#2  Green  [LED_AVAGO_HSME-C120]
LD6#1  Green  [LED_AVAGO_HSME-C120]
LD6#2  Green  [LED_AVAGO_HSME-C120]
LD7#1  Green  [LED_AVAGO_HSME-C120]
LD7#2  Green  [LED_AVAGO_HSME-C120]
LD8#1  Green  [LED_AVAGO_HSME-C120]
LD8#2  Green  [LED_AVAGO_HSME-C120]
R42#1  1k  [RESC1608X55N]
R42#2  1k  [RESC1608X55N]
R43  1k  [RESC1608X55N]
R44  1k  [RESC1608X55N]
R46#1  10k  [RESC1608X55N]
R46#2  10k  [RESC1608X55N]
R47#1  10k  [RESC1608X55N]
R47#2  10k  [RESC1608X55N]
R48#1  10k  [RESC1608X55N]
R48#2  10k  [RESC1608X55N]
R55#1  1k  [RESC1608X55N]
R55#2  1k  [RESC1608X55N]
R56#1  10k  [RESC1608X55N]
R56#2  10k  [RESC1608X55N]
R57#1  1k  [RESC1608X55N]
R57#2  1k  [RESC1608X55N]
R58#1  10k  [RESC1608X55N]
R58#2  10k  [RESC1608X55N]
R59#1  1k  [RESC1608X55N]
R59#2  1k  [RESC1608X55N]
R60#1  10k  [RESC1608X55N]
R60#2  10k  [RESC1608X55N]

### Ports
i_adc (in)

### Nets
GND: C22#1.1 C22#2.1 IC4#1.12(V-) IC4#2.12(V-) IC8.2(A) IC8.3(A) IC8.6(A) IC8.7(A) R60#2.2
P5V0SB: C22#1.2 C22#2.2 IC4#1.3(V+) IC4#2.3(V+) LD5#1.2(A) LD5#2.2(A) LD6#1.2(A) LD6#2.2(A) LD7#1.2(A) LD7#2.2(A) LD8#1.2(A) LD8#2.2(A) R43.2 R44.2
0.825V: IC4#2.5(IN+) R48#2.1 R60#1.2
0.4125V: IC4#2.9(IN+) R56#2.2 R58#2.1
1.65V: IC4#1.5(IN+) R47#2.2 R48#1.1
1.2375V: IC4#1.9(IN+) R56#1.2 R58#1.1
i_adc: IC4#1.4(IN-) IC4#1.6(IN-) IC4#1.8(IN-) IC4#1.10(IN-) IC4#2.4(IN-) IC4#2.6(IN-) IC4#2.8(IN-) IC4#2.10(IN-) ; port i_adc
LED_1/8: LD8#2.1(C) R59#2.2
LED_2/8: LD7#2.1(C) R57#2.2
LED_3/8: LD6#2.1(C) R55#2.2
LED_4/8: LD5#2.1(C) R42#2.2
LED_5/8: LD8#1.1(C) R59#1.2
LED_6/8: LD7#1.1(C) R57#1.2
LED_7/8: LD6#1.1(C) R55#1.2
LED_8/8: LD5#1.1(C) R42#1.2
P2V5REF: IC8.1(C) IC8.8(REF) R43.1 R44.1 R46#1.1
NetIC4#1_1: IC4#1.1(OUT) R55#1.1
NetIC4#1_2: IC4#1.2(OUT) R42#1.1
NetIC4#1_7: IC4#1.7(IN+) R48#1.2 R56#1.1
NetIC4#1_11: IC4#1.11(IN+) R58#1.2 R60#1.1
NetIC4#1_13: IC4#1.13(OUT) R59#1.1
NetIC4#1_14: IC4#1.14(OUT) R57#1.1
NetIC4#2_1: IC4#2.1(OUT) R55#2.1
NetIC4#2_2: IC4#2.2(OUT) R42#2.1
NetIC4#2_7: IC4#2.7(IN+) R48#2.2 R56#2.1
NetIC4#2_11: IC4#2.11(IN+) R58#2.2 R60#2.1
NetIC4#2_13: IC4#2.13(OUT) R59#2.1
NetIC4#2_14: IC4#2.14(OUT) R57#2.1
NetR46#1_2: R46#1.2 R47#1.1
NetR46#2_1: R46#2.1 R47#1.2
NetR46#2_2: R46#2.2 R47#2.1

Not connected (* = marked no-connect by the designer): IC8 4(NC) 5(NC)

### Library data of the parts
C22#1 C22#2 = CC0402_100NF_25V_10%_X7R_YUDEN_TMK105B7104KVHF: as C6 on sheet PWR_stage_AC; Part Number: CC0402_100NF_25V_10%_X7R_YUDEN_TMK105B7104KVHF; Component Kind: Standard; Component Type: Standard; Pin Count: 2; Value: 100nF; Status: Not Recommended; Manufacturer Part Number: TMK105B7104KVHF; Case: 0402; Mounted: Yes; Socket: No; SMD: Yes; Sense: No; HelpURL: \\cern.ch\dfs\Applications\Altium\Datasheets\CC0402_TAIYO-YUDEN_TMK105B7104KVHF.pdf; Author: CERN DEM JLC; CreateDate: 10/05/2017; LatestRevisionDate: 10/05/2017; ComponentHeight: 0.55mm
IC4#1 IC4#2 = LM339AD: Quad Operational Amplifier; Part Description: Quad Differential Comparator; Manufacturer: TEXAS INSTRUMENTS; PressFit: No; Bonding: No; Part Number: LM339AD; Component Kind: Standard; Component Type: Standard; Device: LM339AD; PackageDescription: SOIC 14, Pitch 1.27mm - Body 4x8.75mm, IPC Medium Density; Manufacturer Part Number: LM339AD; Pin Count: 14; Case: SOIC14; Mounted: Yes; Socket: No; SMD: Yes; Sense: No; ComponentHeight: 1.75mm; Author: CERN DEM JLC; HelpURL: \\cern.ch\dfs\Applications\Altium\Datasheets\LM339AD.pdf; CreateDate: 09.03.2011; LatestRevisionDate: 09.03.2011
IC8 = TL431CD: Precision Programmable Reference; Part Description: Vref (2.5V) To 36V 2% Precision Programmable Reference; Manufacturer: TEXAS INSTRUMENTS; PressFit: No; Bonding: No; Part Number: TL431CD; Component Kind: Standard; Component Type: Standard; Device: TL431CD; PackageDescription: SOIC 8, Pitch 1.27mm, Body 4x5mm, IPC Medium Density; Manufacturer Part Number: TL431CD; Pin Count: 8; Case: SOIC8; Mounted: Yes; Socket: No; SMD: Yes; Sense: No; ComponentHeight: 1.75mm; HelpURL: \\cern.ch\dfs\Applications\Altium\Datasheets\TL431CD.pdf; Author: CERN DEM JLC; CreateDate: 18.01.2011; LatestRevisionDate: 28.02.2011
LD5#1 LD5#2 LD6#1 LD6#2 LD7#1 LD7#2 LD8#1 LD8#2 = LED_AVAGO_HSME-C120: LED Green 1C 2A; Part Description: High Performance Right Angle Chip Green LED; Manufacturer: AVAGO TECHNOLOGIES; PressFit: No; Bonding: No; Part Number: LED_AVAGO_HSME-C120; Component Kind: Standard; Component Type: Standard; Color: Green; PackageDescription: Green Chip LED, 2-Leads, Body 1.7x1.1mm, Side Emitting Package; Manufacturer Part Number: HSME-C120; Pin Count: 2; Mounted: Yes; Socket: No; SMD: Yes; Sense: No; ComponentHeight: 0.7mm; HelpURL: \\cern.ch\dfs\Applications\Altium\Datasheets\LED_AVAGO_HSME-C120.pdf; ComponentLink1URL: \\cern.ch\dfs\Applications\Altium\Datasheets\LED_AVAGO_HSME-C110_DESIGN-GUIDE.pdf; ComponentLink1Description: Design Guide; Author: CERN DEM JMW; CreateDate: 22.07.2009; LatestRevisionDate: 20.06.2012
R42#1 R42#2 R43 R44 R55#1 R55#2 R57#1 R57#2 R59#1 R59#2 = R0603_1K_1%_0.1W_100PPM: Resistor - 1%; Part Description: General Purpose Thick Film Chip Resistor; Manufacturer: GENERIC; Manufacturer1 Part Number: NRC06F1001TRF; Power: 0.1W; TC: ±100ppm/°C; PressFit: No; Part Number: R0603_1K_1%_0.1W_100PPM; Component Kind: Standard; Component Type: Standard; Pin Count: 2; Value: 1k; Status: Preferred; Tolerance: ±1%; Manufacturer Part Number: R0603_1K_1%_0.1W_100PPM; Case: 0603; Mounted: Yes; Sense: No; Socket: No; SMD: Yes; Manufacturer1 Example: NIC COMPONENT; Manufacturer1 ComponentHeight: 0.55mm; HelpURL: \\cern.ch\dfs\Applications\Altium\Datasheets\R0603_NIC_NRC.pdf; Author: CERN DEM JLC; CreateDate: 03.12.2007; LatestRevisionDate: 13.03.2008
R46#1 R46#2 R47#1 R47#2 R48#1 R48#2 R56#1 R56#2 R58#1 R58#2 R60#1 R60#2 = R0603_10K_1%_0.1W_100PPM: Resistor - 1%; Part Description: General Purpose Thick Film Chip Resistor; Manufacturer: GENERIC; Manufacturer1 Part Number: NRC06F1002TRF; Power: 0.1W; TC: ±100ppm/°C; PressFit: No; Part Number: R0603_10K_1%_0.1W_100PPM; Component Kind: Standard; Component Type: Standard; Pin Count: 2; Value: 10k; Status: Preferred; Tolerance: ±1%; Manufacturer Part Number: R0603_10K_1%_0.1W_100PPM; Case: 0603; Mounted: Yes; Sense: No; Socket: No; SMD: Yes; Manufacturer1 Example: NIC COMPONENT; Manufacturer1 ComponentHeight: 0.55mm; HelpURL: \\cern.ch\dfs\Applications\Altium\Datasheets\R0603_NIC_NRC.pdf; Author: CERN DEM JLC; CreateDate: 03.12.2007; LatestRevisionDate: 13.03.2008

## Sheet Mechanics.SchDoc
size A4
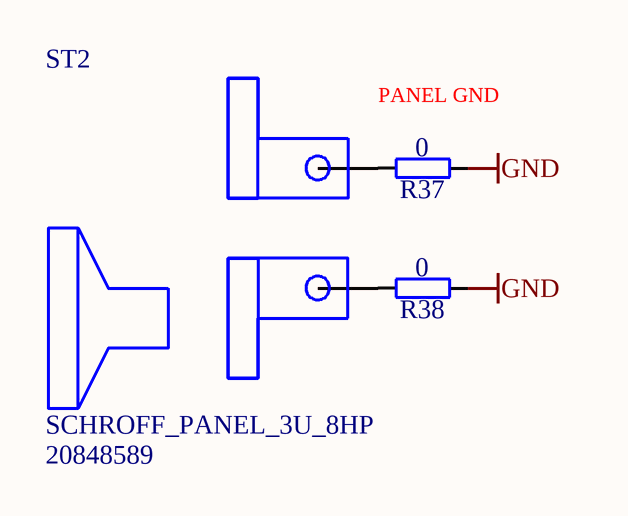
[diagram p3: Mechanics.SchDoc]

### Parts
R37  0  [RESC1608X55N]
R38  0  [RESC1608X55N]
ST2  SCHROFF_PANEL_3U_8HP  Manufacturer Part Number 2: 20848589  [SCHROFF_PANEL_3HP_8U_CPCIS_AC_PSU]

### Nets
GND: R37.1 R38.1
NetR37_2: R37.2 ST2.1
NetR38_2: R38.2 ST2.0

### Notes on the sheet
- PANEL GND

### Library data of the parts
R37 R38 = R0603_0R_JUMPER: as R49 on sheet PWR_stage_AC; Part Number: R0603_0R_JUMPER; Component Kind: Standard; Component Type: Standard; Pin Count: 2; Value: 0; Status: Preferred; Manufacturer Part Number: R0603_0R_JUMPER; Case: 0603; Mounted: Yes; Sense: No; Socket: No; SMD: Yes; Manufacturer1 Example: NIC COMPONENT; Manufacturer1 ComponentHeight: 0.55mm; HelpURL: \\cern.ch\dfs\Applications\Altium\Datasheets\R0603_NIC_NRC.pdf; Author: CERN DEM JLC; CreateDate: 03.12.2007; LatestRevisionDate: 13.03.2008
ST2 = SCHROFF_PANEL_3U_8HP_CPCIS_PSU: Schroff 8HP 4U EUROCARD Panel with ejector; Manufacturer: Schroff; Manufacturer Part Number: 20848589

## Nets that join several sheets
5VSTBY: CPCIS_PWR_MOD_AC (J2.C5 J2.C6 J2.D6), PWR_stage_AC (R24.2)
GND: CPCIS_PWR_MOD_AC (16 pins), PWR_stage_AC (20 pins), LED_bargraph (9 pins), Mechanics (R37.1 R38.1)
P3V3: CPCIS_PWR_MOD_AC (6 pins), PWR_stage_AC (C6.2 IC12.5)
P5V0SB: PWR_stage_AC (IC15.4 R24.1), LED_bargraph (14 pins)
P12V0_OUT: CPCIS_PWR_MOD_AC (J2.P8 J2.P9), PWR_stage_AC (7 pins)
+12V_Sense: CPCIS_PWR_MOD_AC (J2.A3), PWR_stage_AC (R41.1)
CUR_SHARE: CPCIS_PWR_MOD_AC (D6.1 J2.B2 R36.2), PWR_stage_AC (R49.1)
i_adc: PWR_stage_AC (IC12.1 R45.2), LED_bargraph (8 pins)
RTN_Sense: CPCIS_PWR_MOD_AC (J2.A2), PWR_stage_AC (5 pins)